# Altium project LEO_COTS_amps_tripler_rev1.PrjPcb
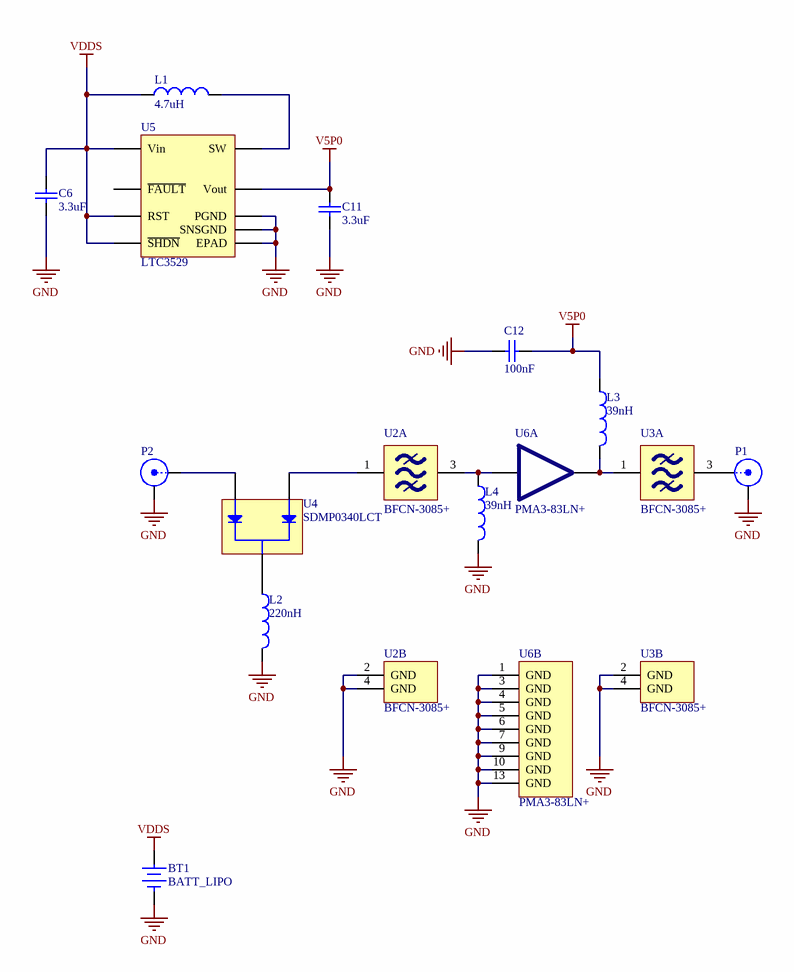
[diagram p0: LEO_COTS_amps_tripler_rev1.SchDoc]
1 sheet, 15 parts. Net scope: global (net labels, ports and power ports of the same name join across sheets).
Board file: LEO_COTS_amps_tripler_rev1.PcbDoc

## Sheet LEO_COTS_amps_tripler_rev1.SchDoc: COTS LEO TX
size A; DocumentNumber: 1; Revision: 1; SheetNumber: 1; SheetTotal: 1

### Parts
BT1  BATT_LIPO  [LIPO_1cm_1cm]
C6  value 3.3uF  [CAPC1608X05N]  (hidden comment: CAP_0603)
C11  value 3.3uF  [CAPC1608X05N]  (hidden comment: CAP_0603)
C12  value 100nF  [CAPC0603X04N]  (hidden comment: CAP_0201)
L1  value 4.7uH  [C0805]  (hidden comment: Inductor)
L2  value 220nH  [0402]  (hidden comment: Inductor)
L3  value 39nH  [0402]  (hidden comment: Inductor)
L4  value 39nH  [0402]  (hidden comment: Inductor)
P1  1909763-1  [1909763-1]  (value not drawn)
P2  1909763-1  [1909763-1]  (value not drawn)
U2  BFCN-3085+  [FV1206]  (parts A,B of 2)
U3  BFCN-3085+  [FV1206]  (parts A,B of 2)
U4  SDMP0340LCT  [SOT-523]
U5  LTC3529  [8-DFN]
U6  PMA3-83LN+  [DQ1225]  (parts A,B of 2)

### Nets
GND: BT1.2(-) C6.1 C11.1 C12.1 L2.2 L4.2 P1.2(Y) P2.2(Y) U2.2(GND) U2.4(GND) U3.2(GND) U3.4(GND) U5.4(PGND) U5.6(SNSGND) U5.9(EPAD) U6.1(GND) U6.3(GND) U6.4(GND) U6.5(GND) U6.6(GND) U6.7(GND) U6.9(GND) U6.10(GND) U6.13(GND)
V5P0: C11.2 C12.2 L3.1 U5.1(Vout)
VDDS: BT1.1(+) C6.2 L1.1 U5.3(~{SHDN}) U5.7(RST) U5.8(Vin)
NetL1_2: L1.2 U5.2(SW)
NetL2_1: L2.1 U4.3
NetL3_2: L3.2 U3.1(IN) U6.8(OUT)
NetL4_1: L4.1 U2.3(OUT) U6.2(IN)
NetP1_1: P1.1(X) U3.3(OUT)
NetP2_1: P2.1(X) U4.1
NetU2_1: U2.1(IN) U4.2

Not connected (* = marked no-connect by the designer): U5 5(~{FAULT})

### Notes on the sheet
- Title
- Size:
- Date:
- A
- Number:
- Time:
- Revision:
- Sheet
- of
- File:

### Library data of the parts
C6 C11 = CAP_0603: CAP CER 3.3uF 0603; Supplier 1: Digi-Key; Supplier Part Number 1: 445-12446-1-ND
C12 = CAP_0201: CAP CER 100nF 0201
L1-L4 = Inductor: Code_IEC: 1005; Published: 8-Jun-2000; LatestRevisionDate: 29-May-2009; LatestRevisionNote: IPC-7351 Footprint Added.; PackageReference: 0402-A; Publisher: Altium Limited; PackageDescription: Chip Inductor; Code_JEITA: 0402
  L1: Supplier 1: Digi-Key; Supplier Part Number 1: 535-12790-1-ND
  L2: Supplier 1: Coilcraft; Supplier Part Number 1: 0402FL-221XJR_
  L3 L4: Supplier 1: Digi-Key; Supplier Part Number 1: 490-1153-1-ND
P1 P2 = 1909763-1: CONN UMCC JACK STR 50OHM SMD; Supplier 1: Digi-Key; Supplier Part Number 1: A118077CT-ND; Manufacturer Part Number: 1909763-1
U2 U3 = BFCN-3085+: 2800 to 3400 MHz Band-Pass Filter; Supplier 1: Mini-Circuits; Supplier Part Number 1: BFCN-3085+
U4 = SDMP0340LCT: Dual Common Cathode Schottky; Supplier 1: Digi-Key; Supplier Part Number 1: SDMP0340LCT-FDICT-ND
U5 = LTC3529: 5V Boost Converter
U6 = PMA3-83LN+: Wideband LNA; Supplier 1: Mini-Circuits; Supplier Part Number 1: PMA3-83LN+